# Altium project NodeLoRa_GSM.PrjPcb
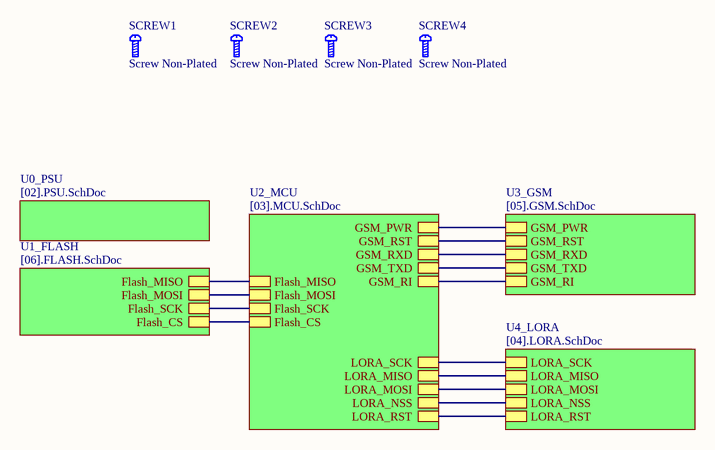
[diagram p0: [01].BLOCK.SchDoc]
6 sheets, 67 parts. Net scope: hierarchical (ports join the sheet entries above them; power ports are global).
Board file: NodeLoRa_GSM.PcbDoc
Sheets:
  [01].BLOCK.SchDoc
    U2_MCU = [03].MCU.SchDoc
    U0_PSU = [02].PSU.SchDoc
    U3_GSM = [05].GSM.SchDoc
    U4_LORA = [04].LORA.SchDoc
    U1_FLASH = [06].FLASH.SchDoc

## Sheet [01].BLOCK.SchDoc
size A4; Organization: Altium Limited; Address1: L3, 12a Rodborough Rd; Address2: Frenchs Forest; Address3: NSW; Address4: Australia 2086

### Parts
SCREW1  Screw Non-Plated  [SCREW_NON-PLATED_2MM]
SCREW2  Screw Non-Plated  [SCREW_NON-PLATED_2MM]
SCREW3  Screw Non-Plated  [SCREW_NON-PLATED_2MM]
SCREW4  Screw Non-Plated  [SCREW_NON-PLATED_2MM]

### Sub-sheets
U0_PSU = [02].PSU.SchDoc: no entries
U1_FLASH = [06].FLASH.SchDoc: Flash_MISO, Flash_MOSI, Flash_SCK, Flash_CS
U2_MCU = [03].MCU.SchDoc: Flash_MISO, Flash_MOSI, Flash_SCK, Flash_CS, GSM_PWR, GSM_RST, GSM_RXD, GSM_TXD, GSM_RI, LORA_SCK, LORA_MISO, LORA_MOSI, LORA_NSS, LORA_RST
U3_GSM = [05].GSM.SchDoc: GSM_PWR, GSM_RST, GSM_RXD, GSM_TXD, GSM_RI
U4_LORA = [04].LORA.SchDoc: LORA_SCK, LORA_MISO, LORA_MOSI, LORA_NSS, LORA_RST

### Nets
GSM_PWR: sheet U2_MCU/GSM_PWR, sheet U3_GSM/GSM_PWR
NetC20_2: sheet U2_MCU/GSM_RST, sheet U3_GSM/GSM_RST
NetIC1_16: sheet U2_MCU/GSM_TXD, sheet U3_GSM/GSM_TXD
NetIC1_17: sheet U2_MCU/GSM_RXD, sheet U3_GSM/GSM_RXD
NetIC1_20: sheet U2_MCU/GSM_RI, sheet U3_GSM/GSM_RI
NetIC1_21: sheet U2_MCU/Flash_SCK, sheet U1_FLASH/Flash_SCK
NetIC1_22: sheet U2_MCU/Flash_MISO, sheet U1_FLASH/Flash_MISO
NetIC1_23: sheet U2_MCU/Flash_MOSI, sheet U1_FLASH/Flash_MOSI
NetIC1_24: sheet U2_MCU/Flash_CS, sheet U1_FLASH/Flash_CS
NetIC1_54: sheet U2_MCU/LORA_NSS, sheet U4_LORA/LORA_NSS
NetIC1_55: sheet U2_MCU/LORA_SCK, sheet U4_LORA/LORA_SCK
NetIC1_56: sheet U2_MCU/LORA_MISO, sheet U4_LORA/LORA_MISO
NetIC1_57: sheet U2_MCU/LORA_MOSI, sheet U4_LORA/LORA_MOSI
NetIC1_58: sheet U2_MCU/LORA_RST, sheet U4_LORA/LORA_RST

### Notes on the sheet
- Title
- Size:
- Date:
- A4
- Number:
- Time:
- Revision:
- Sheet
- of
- File:

### Library data of the parts
SCREW1-SCREW4 = SCREW_NON-PLATED

## Sheet [03].MCU.SchDoc
size A4; Organization: Altium Limited; Address1: L3, 12a Rodborough Rd; Address2: Frenchs Forest; Address3: NSW; Address4: Australia 2086
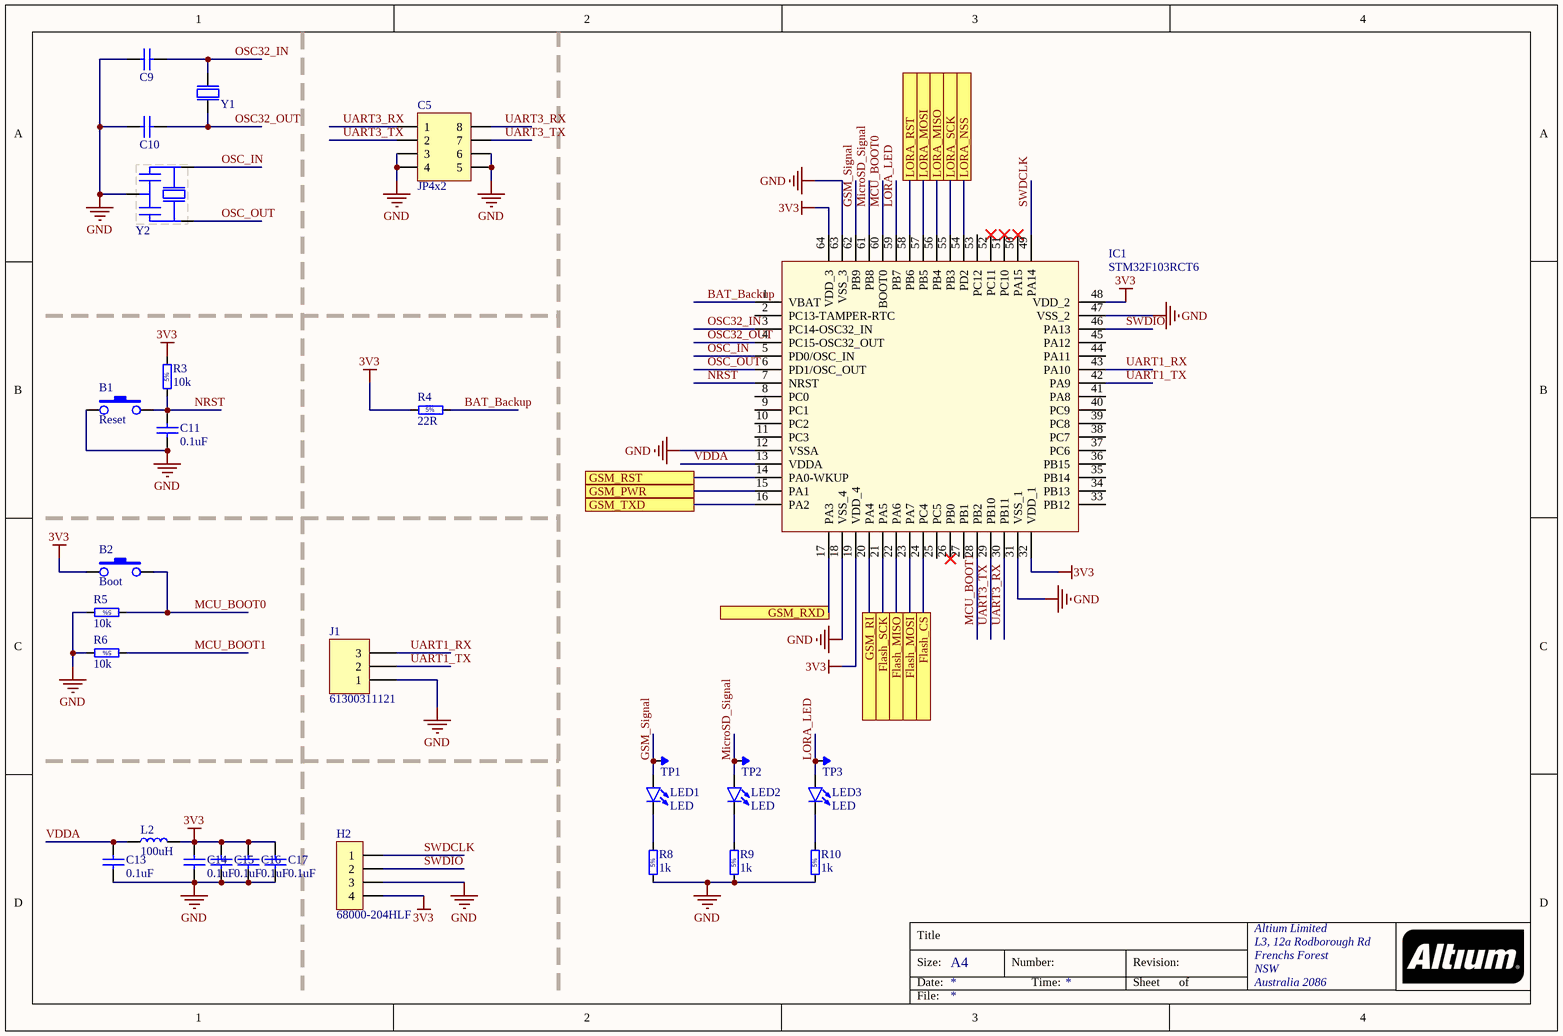
[diagram p1: [03].MCU.SchDoc]

### Parts
B1  Reset  [TACTILE-SWITCH-1101NE]
B2  Boot  [TACTILE-SWITCH-1101NE]
C5  JP4x2  [JP4-D2T]
C9  10pF  [C_0603]  (value not drawn)
C10  10pF  [C_0603]  (value not drawn)
C11  0.1uF  [C_0603]
C13  0.1uF  [C_0603]
C14  0.1uF  [C_0603]
C15  0.1uF  [C_0603]
C16  0.1uF  [C_0603]
C17  0.1uF  [C_0603]
H2  68000-204HLF  [HDR1X4]
IC1  STM32F103RCT6  [QFP50P1000X1000X160-64N]
J1  61300311121  [HDR1X3]
L2  100uH  [Inductor_0805]
LED1  LED  [LED_0805]
LED2  LED  [LED_0805]
LED3  LED  [LED_0805]
R3  10k  [R_0603]
R4  22R  [R_0603]
R5  10k  [R_0603]
R6  10k  [R_0603]
R8  1k  [R_0603]
R9  1k  [R_0603]
R10  1k  [R_0603]
TP1  TESTPOINT  [TP-R40]  (value not drawn)
TP2  TESTPOINT  [TP-R40]  (value not drawn)
TP3  TESTPOINT  [TP-R40]  (value not drawn)
Y1  FC-135 32.7680KA-A0  [Crystal_2P]  (value not drawn)
Y2  CSTCE8M00G52-R0  [Crystal_4P]  (value not drawn)

### Ports
Flash_CS, Flash_MISO, Flash_MOSI, Flash_SCK, GSM_PWR, GSM_RI, GSM_RST, GSM_RXD, GSM_TXD, LORA_MISO, LORA_MOSI, LORA_NSS, LORA_RST, LORA_SCK

### Nets
3V3: B2.1 C14.2 C15.2 C16.2 C17.2 H2.4 IC1.19(VDD_4) IC1.32(VDD_1) IC1.48(VDD_2) IC1.64(VDD_3) L2.2 R3.2 R4.1
GND: B1.1 C5.3 C5.4 C5.5 C5.6 C9.1 C10.1 C11.1 C13.1 C14.1 C15.1 C16.1 C17.1 H2.3 IC1.12(VSSA) IC1.18(VSS_4) IC1.31(VSS_1) IC1.47(VSS_2) IC1.63(VSS_3) J1.1 R5.2 R6.2 R8.1 R9.1 R10.1 Y2.2
BAT_Backup: IC1.1(VBAT) R4.2
GSM_PWR: IC1.15(PA1) ; port GSM_PWR
GSM_Signal: IC1.62(PB9) LED1.A TP1.1
LORA_LED: IC1.59(PB7) LED3.A TP3.1
MCU_BOOT0: B2.2 IC1.60(BOOT0) R5.1
MCU_BOOT1: IC1.28(PB2) R6.1
MicroSD_Signal: IC1.61(PB8) LED2.A TP2.1
NRST: B1.2 C11.2 IC1.7(NRST) R3.1
OSC32_IN: C9.2 IC1.3(PC14-OSC32_IN) Y1.2
OSC32_OUT: C10.2 IC1.4(PC15-OSC32_OUT) Y1.1
OSC_IN: IC1.5(PD0/OSC_IN) Y2.1
OSC_OUT: IC1.6(PD1/OSC_OUT) Y2.3
SWDCLK: H2.1 IC1.49(PA14)
SWDIO: H2.2 IC1.46(PA13)
UART1_RX: IC1.43(PA10) J1.3
UART1_TX: IC1.42(PA9) J1.2
UART3_RX: C5.1 C5.8 IC1.30(PB11)
UART3_TX: C5.2 C5.7 IC1.29(PB10)
VDDA: C13.2 IC1.13(VDDA) L2.1
NetC20_2: IC1.14(PA0-WKUP) ; port GSM_RST
NetIC1_16: IC1.16(PA2) ; port GSM_TXD
NetIC1_17: IC1.17(PA3) ; port GSM_RXD
NetIC1_20: IC1.20(PA4) ; port GSM_RI
NetIC1_21: IC1.21(PA5) ; port Flash_SCK
NetIC1_22: IC1.22(PA6) ; port Flash_MISO
NetIC1_23: IC1.23(PA7) ; port Flash_MOSI
NetIC1_24: IC1.24(PC4) ; port Flash_CS
NetIC1_54: IC1.54(PD2) ; port LORA_NSS
NetIC1_55: IC1.55(PB3) ; port LORA_SCK
NetIC1_56: IC1.56(PB4) ; port LORA_MISO
NetIC1_57: IC1.57(PB5) ; port LORA_MOSI
NetIC1_58: IC1.58(PB6) ; port LORA_RST
NetLED1_K: LED1.K R8.2
NetLED2_K: LED2.K R9.2
NetLED3_K: LED3.K R10.2

Not connected (* = marked no-connect by the designer): IC1 2(PC13-TAMPER-RTC) 8(PC0) 9(PC1) 10(PC2) 11(PC3) 25(PC5) 26(PB0)* 27(PB1) 33(PB12) 34(PB13) 35(PB14) 36(PB15) 37(PC6) 38(PC7) 39(PC8) 40(PC9) 41(PA8) 44(PA11) 45(PA12) 50(PA15)* 51(PC10)* 52(PC11)* 53(PC12)

### Notes on the sheet
- Title
- Size:
- Date:
- A4
- Number:
- Time:
- Revision:
- Sheet
- of
- File:
- (in symbol RC0805FR-0710KL) 5%
- (in symbol RC0805FR-0722RL) 5%
- (in symbol RC0805JR-071KL) 5%

### Library data of the parts
B1 B2 = Button_2P_SMD
C5 = JP4x2: WR-PHD 2.54 mm Dual Socket Header; Manufacturer: W¨¹rth Elektronik eiSos GmbH; partNo: 61300821821; ComponentLink1 Description: Manufacturer; ComponentLink2 Description: Datasheet; NoPins: 08; Created Date: 29 March 2013; ComponentLink1URL: http://www.we-online.com; ComponentLink2URL: http://katalog.we-online.de/em/datasheet/6130xx21821.pdf; Created by: Karrer Zheng
C9 C10 = VJ0805A100JXJPW1BC: Non-polarised capacitor; Part Description: SMD Multilayer Chip Ceramic Capacitor; Manufacturer: Vishay; ID: 3; Voltage: 16VDC; TC: NP0; Tolerance: 5%; Part Number: VJ0805A100JXJPW1BC; Component Kind: Standard; Component Type: Standard; Footprint: CAPC2012X135N; Pin Count: 2; Value: 10pF; Status: Not Recommended; Manufacturer Part Number: VJ0805A100JXJPW1BC; Case: 0805; Mounted: Yes; Socket: No; SMD: Yes; ComponentHeigh: https://www.mouser.vn; Manufacturer1 Example: MDBK
C11 C13-C17 = VJ0805Y104KXXMC: Non-polarised capacitor; Part Description: SMD Multilayer Chip Ceramic Capacitor; Manufacturer: Vishay; ID: 4; Voltage: 25VDC; TC: X7R; Tolerance: 10%; Part Number: VJ0805Y104KXXMC; Component Kind: Standard; Component Type: Standard; Footprint: CAPC2012X135N; Pin Count: 2; Value: 0.1uF; Status: Not Recommended; Manufacturer Part Number: VJ0805Y104KXXMC; Case: 0805; Mounted: Yes; Socket: No; SMD: Yes; ComponentHeigh: https://www.mouser.vn; Manufacturer1 Example: MDBK
H2 = 68000-204HLF: CONN HEADER 4POS .100 STR 15AU; Manufacturer: Amphenol FCI; ID: 7; Detailed Description: 4 Positions Header Connector 0.100" (2.54mm) Through Hole Gold or Gold, GXT™; Part Number: 68000-204HLF; Device: 68000-204HLF; Component Kind: Standard; Component Type: Standard; Manufacturer Part Number: 68000-204HLF; Pin Count: 4; Mounted: Yes; Socket: No; SMD: No; HelpURL: https://www.mouser.vn; Author: MDBK
IC1 = STM32F103RCT6: ARM Microcontrollers - MCU 32BIT Cortex M3 H/D 256 to 512 USB/CAN; Part Description: 32 bit;72 MHz;256 kB;48 kB;12bit;51 I/O; Manufacturer: STMicroelectronics; ID: 1; Part Number: STM32F103RCT6; Device: STM32F103RCT6; Component Kind: Standard; Component Type: Standard; Footprint: LQFP-64; PackageDescription: ARM Microcontrollers - MCU 32BIT Cortex M3 H/D 256 to 512 USB/CAN; Manufacturer Part Number: STM32F103RCT6; Pin Count: 64; Case: LQFP-64; Mounted: Yes; Socket: No; SMD: Yes; ComponentHeight: 1.0mm; HelpURL: https://www.mouser.vn; Author: MDBK; CreateDate: 11/18/2009; LatestRevisionDate: 1/24/2011
J1 = 61300311121: CONN HEADER 3 POS 2.54; Manufacturer: Wurth Electronics Inc.; ID: 8; Detailed Description: 3 Positions Header Connector 0.100" (2.54mm) Through Hole Gold; Part Number: 61300311121; Device: 61300311121; Component Kind: Standard; Component Type: Standard; Manufacturer Part Number: 61300311121; Pin Count: 3; Mounted: Yes; Socket: No; SMD: No; HelpURL: https://www.mouser.vn; Author: MDBK
L2 = LB2016T101M: FIXED IND 100UH 80MA 5.5 OHM SMD; Manufacturer: Taiyo Yuden; ID: 7; Detailed Description: 100µH Shielded Wirewound Inductor 80mA 5.5 Ohm 0603 (1608 Metric); Part Number: LB2016T101M; Value: 100uH; Component Kind: Standard; Component Type: Standard; Footprint: 0805(2016 Metric); Manufacturer Part Number: LB2016T101M; Pin Count: 2; Case: 0805(2016 Metric); Mounted: Yes; Socket: No; SMD: Yes; HelpURL: https://www.mouser.vn; Author: MDBK
LED1-LED3 = LED_0805
R3 R5 R6 = RC0805FR-0710KL: Resistor - 5%; Part Description: General Purpose Chip Resistor; Manufacturer: Yageo; ID: 1; Power: 125 mW (1/8 W); TC: 100 PPM / C; Part Number: RC0805FR-0710KL; Component Kind: Standard; Component Type: Standard; Footprint: RESC2012X60N; Pin Count: 2; Value: 10k; Status: Not recommended; Tolerance: ±5%; Manufacturer Part Number: RC0805FR-0710KL; Case: 0805; Mounted: Yes; Socket: No; SMD: Yes; Author: MDBK
R4 = RC0805FR-0722RL: Resistor - 5%; Part Description: General Purpose Chip Resistor; Manufacturer: Yageo; ID: 5; Power: 125 mW (1/8 W); TC: 100 PPM / C; Part Number: RC0805FR-0722RL; Value: 22R; Component Kind: Standard; Component Type: Standard; Footprint: RESC2012X60N; Pin Count: 2; Status: Not recommended; Tolerance: ±5%; Manufacturer Part Number: RC0805FR-0722RL; Case: 0805; Mounted: Yes; Socket: No; SMD: Yes; Author: MDBK
R8-R10 = RC0805JR-071KL: Resistor - 5%; Part Description: General Purpose Chip Resistor; Manufacturer: Yageo; ID: 2; Power: 125 mW (1/8 W); TC: 100 PPM / C; Part Number: RC0805JR-071KL; Value: 1k; Component Kind: Standard; Component Type: Standard; Footprint: RESC2012X60N; Pin Count: 2; Status: Not recommended; Tolerance: ±5%; Manufacturer Part Number: RC0805JR-071KL; Case: 0805; Mounted: Yes; Socket: No; SMD: Yes; Author: MDBK
Y1 = FC-135 32.7680KA-A0: CRYSTAL 32.7680KHZ 12.5PF SMT; Manufacturer: EPSON; ID: 2; Detailed Description: 32.768kHz ±20ppm Crystal 12.5pF 70 kOhms 2-SMD, No Lead; Part Number: FC-135 32.7680KA-A0; Component Kind: Standard; Component Type: Standard; Device: FC-135 32.7680KA-A0; Footprint: 2-SMD, No Lead; Manufacturer Part Number: FC-135 32.7680KA-A0; Pin Count: 2; Case: 2-SMD, No Lead; Mounted: Yes; Socket: No; SMD: Yes; HelpURL: https://www.mouser.vn; Author: MDBK
Y2 = CSTCE8M00G52-R0: CER RES 8.0000MHZ 10PF SMD; Manufacturer: Murata Electronics North America; ID: 1; Detailed Description: 8MHz Ceramic Resonator Built in Capacitor 10pF ±0.2%  -20°C ~ 80°C Surface Mount; Part Number: CSTCE8M00G52-R0; Component Kind: Standard; Component Type: Standard; Device: CSTCE8M00G52-R0; Footprint: 1206 (3216 Metric); Manufacturer Part Number: CSTCE8M00G52-R0; Pin Count: 3; Case: 1206 (3216 Metric); Mounted: Yes; Socket: No; SMD: Yes; HelpURL: https://www.mouser.vn; Author: MDBK

## Sheet [02].PSU.SchDoc
size A; Organization: Altium Limited; Address1: L3, 12a Rodborough Rd; Address2: Frenchs Forest; Address3: NSW; Address4: Australia 2086
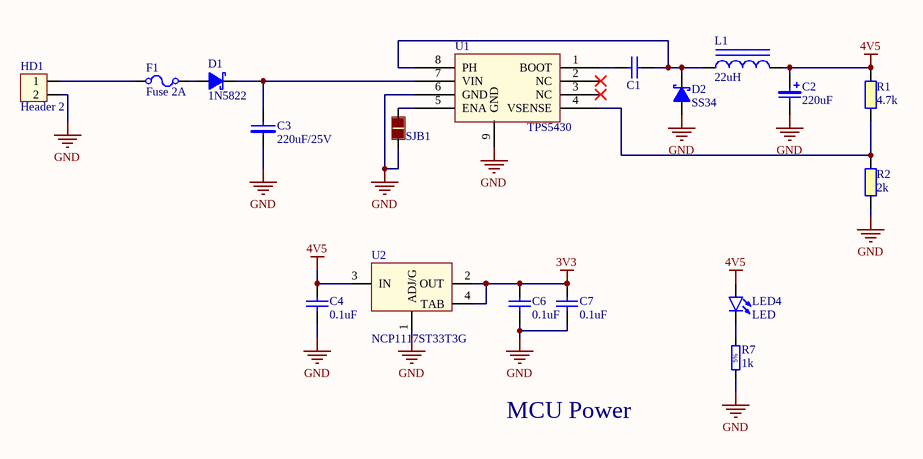
[diagram p2: [02].PSU.SchDoc]

### Parts
C1  0.01uF  [C_0603]  (value not drawn)
C2  220uF  [Tantalum]
C3  220uF/25V  [CAP-ALU-SMD-6.3x7.7x2.2]
C4  0.1uF  [C_0603]
C6  0.1uF  [C_0603]
C7  0.1uF  [C_0603]
D1  1N5822  [SS34]
D2  SS34  [SS34]
F1  Fuse 2A  [FUSE_1812_4530]
HD1  Header 2  [HED2]
L1  22uH  [INDUCTOR]
LED4  LED  [LED_0805]
R1  4.7k  [R_0603]
R2  2k  [R_0603]
R7  1k  [R_0603]
SJB1  SJB_SMD_2_0603  [SJB]  (value not drawn)
U1  TPS5430  [TPS5430]
U2  NCP1117ST33T3G  [AMS1117]

### Nets
3V3: C6.2 C7.2 U2.2(OUT) U2.4(TAB)
4V5: C2.A C4.2 L1.2 LED4.A R1.2 U2.3(IN)
GND: C2.K C3.1 C4.1 C6.1 C7.1 D2.A HD1.2 R2.1 R7.1 SJB1.1 U1.6(GND) U1.9(GND) U2.1(ADJ/G)
NetC1_1: C1.1 U1.1(BOOT)
NetC1_2: C1.2 D2.K L1.1 U1.8(PH)
NetC3_2: C3.2 D1.K U1.7(VIN)
NetD1_A: D1.A F1.2
NetF1_1: F1.1 HD1.1
NetLED4_K: LED4.K R7.2
NetR1_1: R1.1 R2.2 U1.4(VSENSE)
NetSJB1_2: SJB1.2 U1.5(ENA)

Not connected (* = marked no-connect by the designer): U1 2(NC)* 3(NC)*

### Notes on the sheet
- MCU Power
- Title
- Size:
- Date:
- A
- Number:
- Time:
- Revision:
- Sheet
- of
- File:
- (in symbol RC0805JR-071KL) 5%

### Library data of the parts
C1 = CAP_0603
C2 = CAP_TANTA
C3 = Cap 220uF/25V: PANASONIC EEU-TP1E221B CAPACITOR ALUM ELEC, 220UF, 25V, 20%, RADIAL (1 piece)
C4 C6 C7 = CAP_0805
D1 = DIODE_1N5822: 3A 40V SS34
D2 = SS34: DIODE SCHOTTKY 40V 3A SMC; Manufacturer: ON Semiconductor / Fairchild; Element Configuration: Single; Polarity: Standard; Peak Reverse Current: 500uA; Max Surge Current: 100A; Forward Voltage: 500mV; Number of Elements: 1; Max Power Dissipation: 2.27W; Supplier 1: RSComponents; Manufacturer Part Number: SS34; Stock 1: 0; Mount: Surface Mount; Case/Package: SMC; Number of Pins: 2; Contact Plating: Matte,Tin; Number of Terminals: 2; Min Operating Temperature: -55°C; Max Operating Temperature: 150°C; Packaging: Tape and Reel; Output Current: 3A; Package Quantity: 1; Voltage Rating (DC): 40V; Current Rating: 3A; Forward Current: 3A; Max Repetitive Reverse Voltage (Vrrm): 40V; Max Reverse Leakage Current: 500uA; Peak Non-Repetitive Surge Current: 100A; Max Forward Surge Current (Ifsm): 100A; Current: 3A; Voltage: 40V; Average Rectified Current: 3A; Max Reverse Voltage (DC): 40V; Length: 7.15mm; Height: 2.75mm; Width: 6.25mm; Radiation Hardening: No; REACH SVHC: No SVHC; Lead Free: Lead Free; ComponentLink1URL: https://www.fairchildsemi.com/datasheets/SS/SS39.pdf?src-supplier=Avnet; ComponentLink1Description: https://www.fairchildsemi.com/datasheets/SS/SS39.pdf?src-supplier=Avnet; ComponentLink2URL: http://www.mouser.com/ds/2/149/SS34-197057.pdf?src-supplier=Mouser; ComponentLink2Description: http://www.mouser.com/ds/2/149/SS34-197057.pdf?src-supplier=Mouser; ComponentLink3URL: http://www.jameco.com/Jameco/Products/ProdDS/1090087.pdf?src-supplier=Jameco; ComponentLink3Description: http://www.jameco.com/Jameco/Products/ProdDS/1090087.pdf?src-supplier=Jameco; ComponentLink4URL: https://www.fairchildsemi.com/package-drawings/DO/DO214AB.pdf?src-supplier=Digi-Key; ComponentLink4Description: https://www.fairchildsemi.com/package-drawings/DO/DO214AB.pdf?src-supplier=Digi-Key; ComponentLink5URL: http://www.farnell.com/datasheets/1774678.pdf?src-supplier=Element14; ComponentLink5Description: http://www.farnell.com/datasheets/1774678.pdf?src-supplier=Element14; ComponentLink6URL: http://www.jameco.com/Jameco/Products/ProdDS/1547649.pdf?src-supplier=Jameco; ComponentLink6Description: http://www.jameco.com/Jameco/Products/ProdDS/1547649.pdf?src-supplier=Jameco; Supplier Part Number 1: 1662321
F1 = FUSE_SMD
HD1 = Hed2: Header 2 (Green); Value: Header 2
L1 = INDUCTOR
LED4 = LED_0805
R1 R2 = RES_0603
R7 = RC0805JR-071KL: as R8 on sheet [03].MCU; Part Number: RC0805JR-071KL; Value: 1k; Component Kind: Standard; Component Type: Standard; Footprint: RESC2012X60N; Pin Count: 2; Status: Not recommended; Tolerance: ±5%; Manufacturer Part Number: RC0805JR-071KL; Case: 0805; Mounted: Yes; Socket: No; SMD: Yes; Author: MDBK
U2 = NCP1117ST33T3G: IC REG LINEAR 3.3V 1A SOT223

## Sheet [05].GSM.SchDoc
size A; Organization: Altium Limited; Address1: L3, 12a Rodborough Rd; Address2: Frenchs Forest; Address3: NSW; Address4: Australia 2086
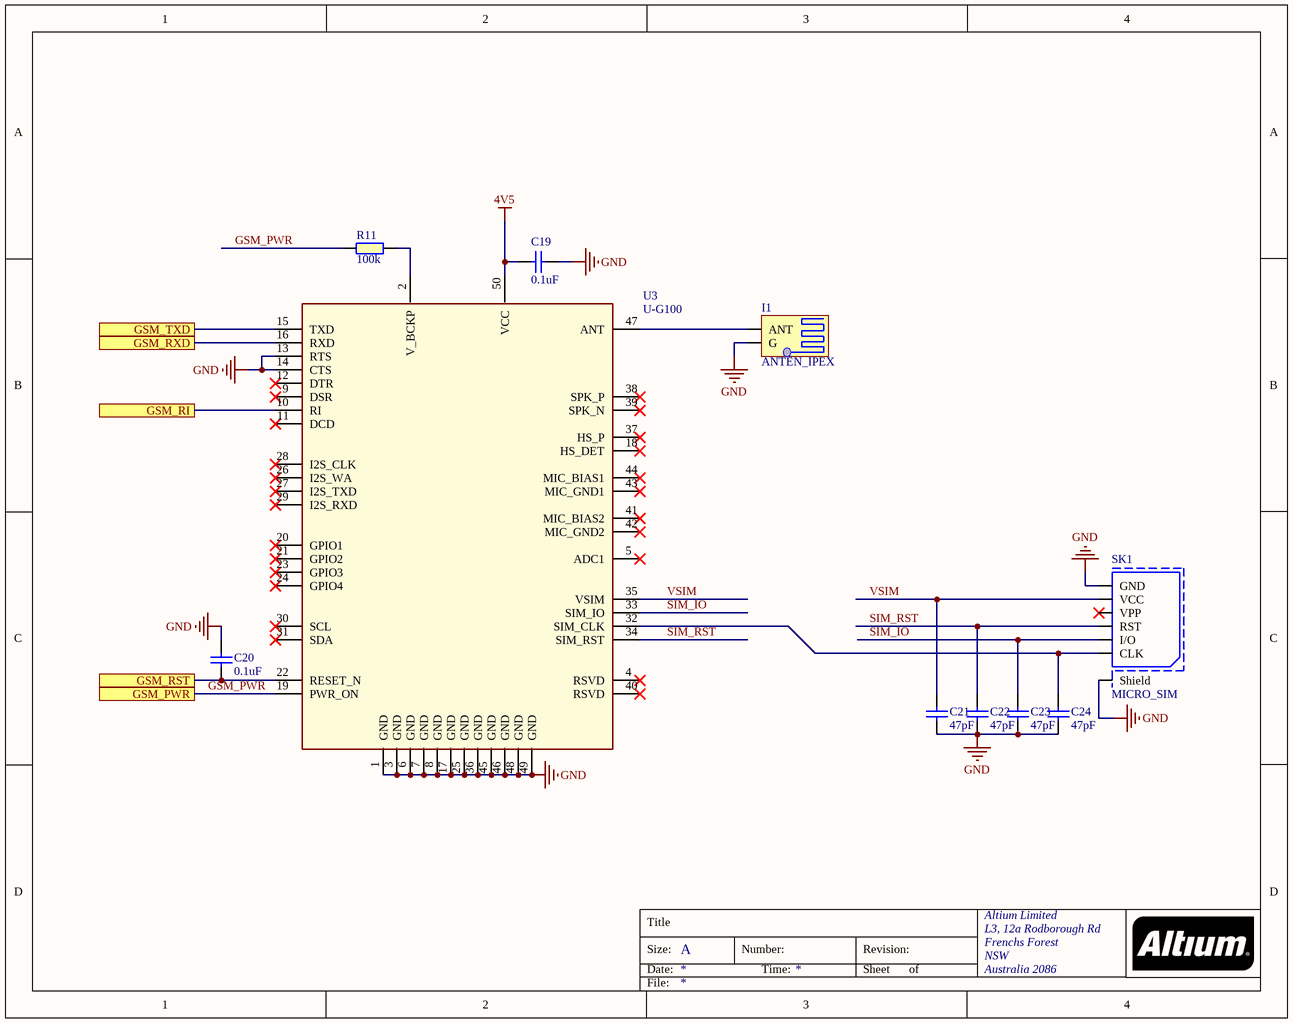
[diagram p3: [05].GSM.SchDoc]

### Parts
C19  0.1uF  [C_0603]
C20  0.1uF  [C_0603]
C21  47pF  [C_0603]
C22  47pF  [C_0603]
C23  47pF  [C_0603]
C24  47pF  [C_0603]
I1  ANTEN_IPEX  [ANTEN_IPEX]
R11  100k  [R_0603]
SK1  MICRO_SIM  [MICRO_SIM]
U3  U-G100  [G100_UBLOX]

### Ports
GSM_PWR, GSM_RI, GSM_RST, GSM_RXD, GSM_TXD

### Nets
4V5: C19.2 U3.50(VCC)
GND: C19.1 C20.1 C21.1 C22.1 C23.1 C24.1 I1.2(G) SK1.C5(GND) SK1.SH1(Shield) U3.1(GND) U3.3(GND) U3.6(GND) U3.7(GND) U3.8(GND) U3.13(RTS) U3.14(CTS) U3.17(GND) U3.25(GND) U3.36(GND) U3.45(GND) U3.46(GND) U3.48(GND) U3.49(GND)
GSM_PWR: R11.1 U3.19(PWR_ON) ; port GSM_PWR
SIM_IO: C23.2 SK1.C7(I/O) U3.33(SIM_IO)
SIM_RST: C22.2 SK1.C2(RST) U3.34(SIM_RST)
VSIM: C21.2 SK1.C1(VCC) U3.35(VSIM)
NetC20_2: C20.2 U3.22(RESET_N) ; port GSM_RST
NetC24_2: C24.2 SK1.C3(CLK) U3.32(SIM_CLK)
NetI1_1: I1.1(ANT) U3.47(ANT)
NetIC1_16: U3.15(TXD) ; port GSM_TXD
NetIC1_17: U3.16(RXD) ; port GSM_RXD
NetIC1_20: U3.10(RI) ; port GSM_RI
NetR11_2: R11.2 U3.2(V_BCKP)

Not connected (* = marked no-connect by the designer): SK1 C6(VPP)*; U3 4(RSVD)* 5(ADC1)* 9(DSR)* 11(DCD)* 12(DTR)* 18(HS_DET)* 20(GPIO1)* 21(GPIO2)* 23(GPIO3)* 24(GPIO4)* 26(I2S_WA)* 27(I2S_TXD)* 28(I2S_CLK)* 29(I2S_RXD)* 30(SCL)* 31(SDA)* 37(HS_P)* 38(SPK_P)* 39(SPK_N)* 40(RSVD)* 41(MIC_BIAS2)* 42(MIC_GND2)* 43(MIC_GND1)* 44(MIC_BIAS1)*

### Notes on the sheet
- Title
- Size:
- Date:
- A
- Number:
- Time:
- Revision:
- Sheet
- of
- File:

### Library data of the parts
C19-C24 = CAP_0805
R11 = RES_0603

## Sheet [04].LORA.SchDoc
size A; Organization: Altium Limited; Address1: L3, 12a Rodborough Rd; Address2: Frenchs Forest; Address3: NSW; Address4: Australia 2086
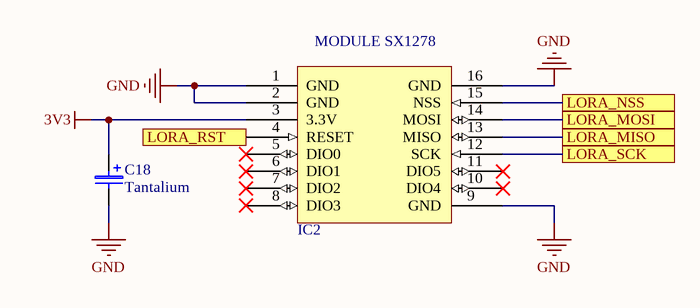
[diagram p4: [04].LORA.SchDoc]

### Parts
C18  Tantalium  [Case A]
IC2  MODULE SX1278  [LORA_RA01]

### Ports
LORA_MISO, LORA_MOSI, LORA_NSS, LORA_RST, LORA_SCK

### Nets
3V3: C18.A IC2.3(3.3V)
GND: C18.K IC2.1(GND) IC2.2(GND) IC2.9(GND) IC2.16(GND)
NetIC1_54: IC2.15(NSS) ; port LORA_NSS
NetIC1_55: IC2.12(SCK) ; port LORA_SCK
NetIC1_56: IC2.13(MISO) ; port LORA_MISO
NetIC1_57: IC2.14(MOSI) ; port LORA_MOSI
NetIC1_58: IC2.4(RESET) ; port LORA_RST

Not connected (* = marked no-connect by the designer): IC2 5(DIO0)* 6(DIO1)* 7(DIO2)* 8(DIO3)* 10(DIO4)* 11(DIO5)*

### Notes on the sheet
- Title
- Size:
- Date:
- A
- Number:
- Time:
- Revision:
- Sheet
- of
- File:

### Library data of the parts
C18 = CASE A
IC2 = SX1278IMLTRT: IC RF TXRX 802.15.4 28VQFN; Manufacturer: Semtech Corporation; Manufacturer Part Number: SX1278_Ra01; ID: 8; Detailed Description: IC RF TxRx Only 802.15.4 LoRa™ 137MHz ~ 1.02GHz 28-VQFN Exposed Pad; Part Number: SX1278IMLTRT; Component Kind: Standard; Component Type: Standard; Device: MODULE SX1278; Footprint: VQFN Exposed Pad; Pin Count: 16; Case: 16 VQFN Exposed Pad; Mounted: Yes; Socket: No; SMD: Yes; HelpURL: https://www.mouser.vn; Author: MDBK

## Sheet [06].FLASH.SchDoc
size A; Organization: Altium Limited; Address1: L3, 12a Rodborough Rd; Address2: Frenchs Forest; Address3: NSW; Address4: Australia 2086
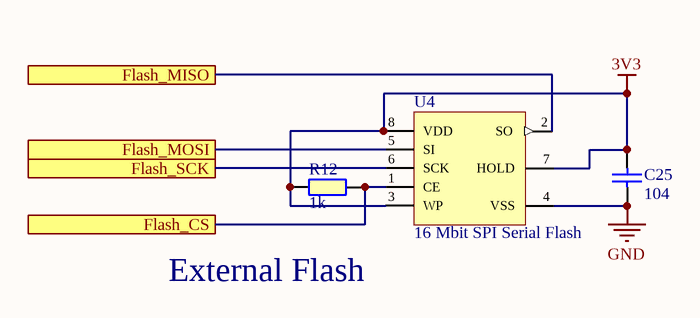
[diagram p5: [06].FLASH.SchDoc]

### Parts
C25  104  [C_0603]
R12  1k  [R_0603]
U4  16 Mbit SPI Serial Flash  [SST25]

### Ports
Flash_CS, Flash_MISO, Flash_MOSI, Flash_SCK

### Nets
3V3: C25.2 R12.1 U4.3(WP) U4.7(HOLD) U4.8(VDD)
GND: C25.1 U4.4(VSS)
NetIC1_21: U4.6(SCK) ; port Flash_SCK
NetIC1_22: U4.2(SO) ; port Flash_MISO
NetIC1_23: U4.5(SI) ; port Flash_MOSI
NetIC1_24: R12.2 U4.1(CE) ; port Flash_CS

### Notes on the sheet
- External Flash
- Title
- Size:
- Date:
- A
- Number:
- Time:
- Revision:
- Sheet
- of
- File:

### Library data of the parts
C25 = Cap SMD 0805: Capacitor SMD; Published: 8-Jun-2000; LatestRevisionDate: 17-Jul-2002; LatestRevisionNote: Re-released for DXP Platform.; PackageReference: RAD-0.3; Publisher: Altium Limited; Value: 104
R12 = RES_0805
U4 = SST25VF016B: MPN: SST25VF016B-50-4I-S2AF; OC_FARNELL: 1368695; OC_NEWARK: 82R4471; PACKAGE: SOIC-8; SUPPLIER: SILICON STORAGE TECHNOLOGY

## Nets that join several sheets
3V3: [03].MCU (13 pins), [02].PSU (C6.2 C7.2 U2.2 U2.4), [04].LORA (C18.A IC2.3), [06].FLASH (5 pins)
4V5: [02].PSU (6 pins), [05].GSM (C19.2 U3.50)
GND: [03].MCU (26 pins), [02].PSU (13 pins), [05].GSM (23 pins), [04].LORA (5 pins), [06].FLASH (C25.1 U4.4)
GSM_PWR: [03].MCU (IC1.15), [05].GSM (R11.1 U3.19)
NetC20_2: [03].MCU (IC1.14), [05].GSM (C20.2 U3.22)
NetIC1_16: [03].MCU (IC1.16), [05].GSM (U3.15)
NetIC1_17: [03].MCU (IC1.17), [05].GSM (U3.16)
NetIC1_20: [03].MCU (IC1.20), [05].GSM (U3.10)
NetIC1_21: [03].MCU (IC1.21), [06].FLASH (U4.6)
NetIC1_22: [03].MCU (IC1.22), [06].FLASH (U4.2)
NetIC1_23: [03].MCU (IC1.23), [06].FLASH (U4.5)
NetIC1_24: [03].MCU (IC1.24), [06].FLASH (R12.2 U4.1)
NetIC1_54: [03].MCU (IC1.54), [04].LORA (IC2.15)
NetIC1_55: [03].MCU (IC1.55), [04].LORA (IC2.12)
NetIC1_56: [03].MCU (IC1.56), [04].LORA (IC2.13)
NetIC1_57: [03].MCU (IC1.57), [04].LORA (IC2.14)
NetIC1_58: [03].MCU (IC1.58), [04].LORA (IC2.4)